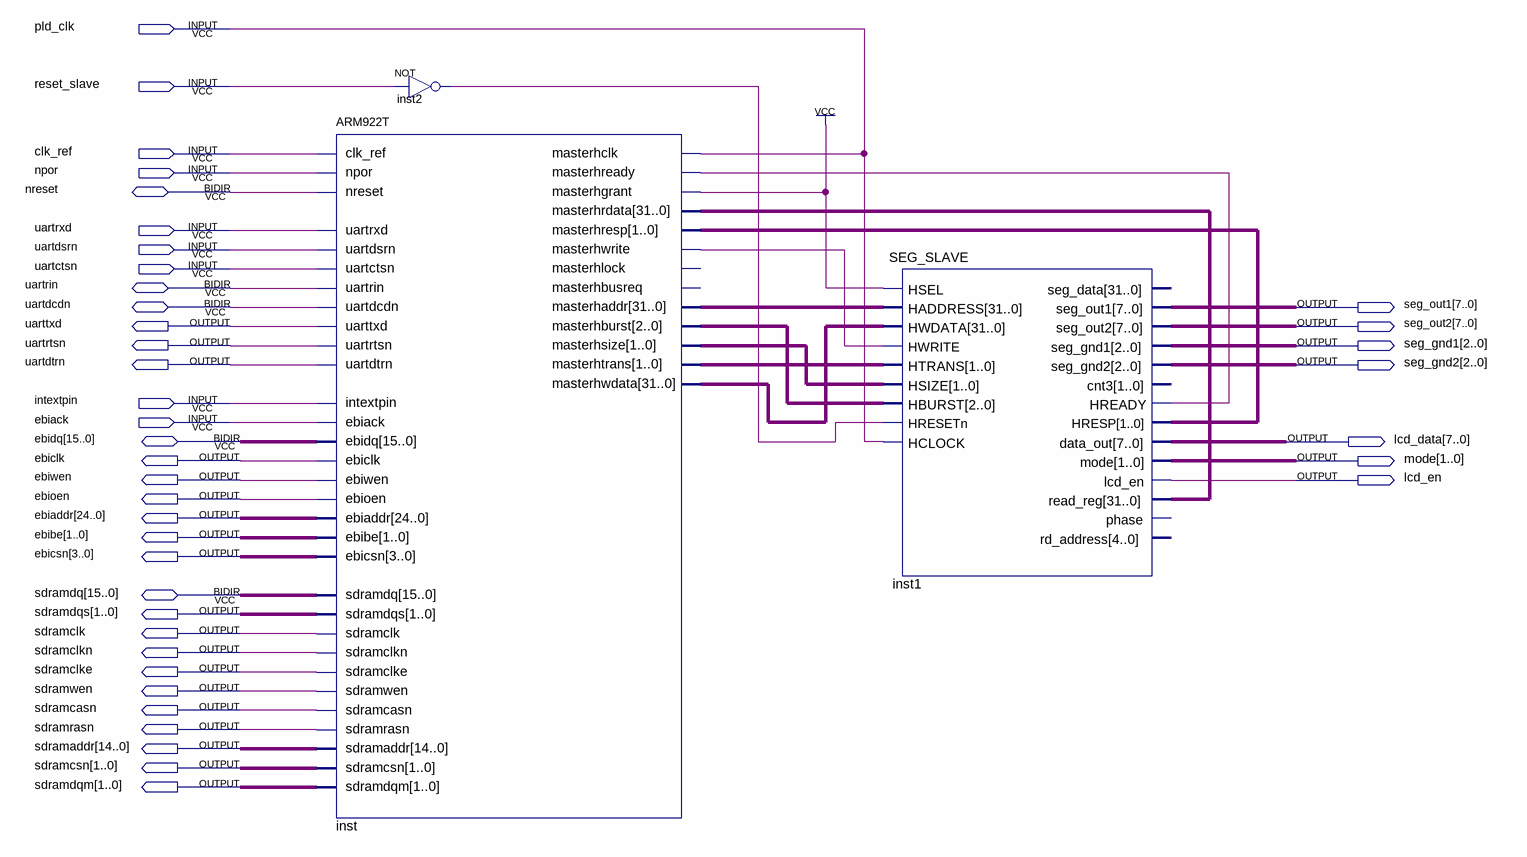
[diagram p0: schematic sheet]
// Quartus schematic TOP_SAMPLE.bdf as structural Verilog: 3 symbols, 40 pins
module TOP_SAMPLE (
  input  pld_clk,
  input  reset_slave,
  input  clk_ref,
  input  npor,
  input  uartrxd,
  input  uartdsrn,
  input  uartctsn,
  input  intextpin,
  input  ebiack,
  inout  nreset,
  inout  uartrin,
  inout  uartdcdn,
  inout  [15:0] ebidq,
  inout  [15:0] sdramdq,
  output [7:0] seg_out1,
  output uarttxd,
  output [7:0] seg_out2,
  output uartrtsn,
  output [2:0] seg_gnd1,
  output uartdtrn,
  output [2:0] seg_gnd2,
  output [7:0] lcd_data,
  output ebiclk,
  output [1:0] mode,
  output ebiwen,
  output lcd_en,
  output ebioen,
  output [24:0] ebiaddr,
  output [1:0] ebibe,
  output [3:0] ebicsn,
  output [1:0] sdramdqs,
  output sdramclk,
  output sdramclkn,
  output sdramclke,
  output sdramwen,
  output sdramcasn,
  output sdramrasn,
  output [14:0] sdramaddr,
  output [1:0] sdramcsn,
  output [1:0] sdramdqm
);

  wire inst1_hready, inst2_out, inst_masterhwrite;
  wire [1:0] inst1_hresp, inst_masterhsize, inst_masterhtrans;
  wire [2:0] inst_masterhburst;
  wire [31:0] inst1_read_reg, inst_masterhaddr, inst_masterhwdata;

  ARM922T inst (
    .clk_ref(clk_ref), .npor(npor), .uartrxd(uartrxd), .uartdsrn(uartdsrn), .uartctsn(uartctsn),
    .intextpin(intextpin), .ebiack(ebiack), .masterhclk(pld_clk), .masterhready(inst1_hready),
    .masterhgrant(1'b1), .masterhrdata(inst1_read_reg), .masterhresp(inst1_hresp), .uarttxd(uarttxd),
    .uartrtsn(uartrtsn), .uartdtrn(uartdtrn), .ebiclk(ebiclk), .ebiwen(ebiwen), .ebioen(ebioen),
    .ebiaddr(ebiaddr), .ebibe(ebibe), .ebicsn(ebicsn), .sdramclk(sdramclk), .sdramclkn(sdramclkn),
    .sdramclke(sdramclke), .sdramwen(sdramwen), .sdramcasn(sdramcasn), .sdramrasn(sdramrasn),
    .sdramaddr(sdramaddr), .sdramcsn(sdramcsn), .sdramdqm(sdramdqm), .masterhwrite(inst_masterhwrite),
    .masterhaddr(inst_masterhaddr), .masterhburst(inst_masterhburst), .masterhsize(inst_masterhsize),
    .masterhtrans(inst_masterhtrans), .masterhwdata(inst_masterhwdata), .nreset(nreset), .uartrin(uartrin),
    .uartdcdn(uartdcdn), .ebidq(ebidq), .sdramdq(sdramdq), .sdramdqs(sdramdqs));  // open: masterhlock, masterhbusreq
  not inst2 (inst2_out, reset_slave);
  SEG_SLAVE inst1 (
    .HSEL(1'b1), .HADDRESS(inst_masterhaddr), .HWDATA(inst_masterhwdata), .HWRITE(inst_masterhwrite),
    .HTRANS(inst_masterhtrans), .HSIZE(inst_masterhsize), .HBURST(inst_masterhburst), .HRESETn(inst2_out),
    .HCLOCK(pld_clk), .seg_out1(seg_out1), .seg_out2(seg_out2), .seg_gnd1(seg_gnd1), .seg_gnd2(seg_gnd2),
    .HREADY(inst1_hready), .HRESP(inst1_hresp), .data_out(lcd_data), .mode(mode), .lcd_en(lcd_en),
    .read_reg(inst1_read_reg));  // open: seg_data, cnt3, phase, rd_address
endmodule
